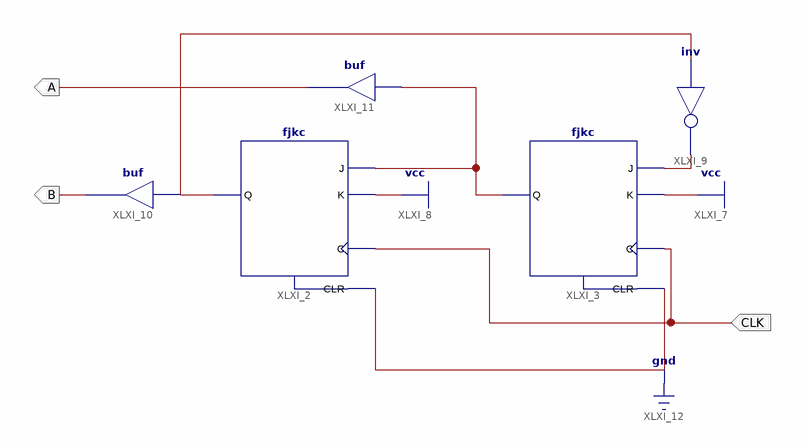
[diagram p0: schematic sheet 1]
// Xilinx ISE schematic Counter0_2.sch (spartan6) as structural Verilog: 5 symbols, 3 ports
module Counter0_2 (
  input  CLK,
  output B,
  output A
);

  wire XLXN_5, XLXN_7, XLXN_8;

  fjkc XLXI_2 (.C(CLK), .CLR(1'b0), .J(XLXN_8), .K(1'b1), .Q(XLXN_7));
  fjkc XLXI_3 (.C(CLK), .CLR(1'b0), .J(XLXN_5), .K(1'b1), .Q(XLXN_8));
  not XLXI_9 (XLXN_5, XLXN_7);
  buf XLXI_10 (B, XLXN_7);
  buf XLXI_11 (A, XLXN_8);
endmodule
